# Altium schematic sheet Connector-side-2.SchDoc: =ProjectDescription
size 297 x 209 mm; Address1: Address1; Address2: Address2; Address3: Address3; Address4: Address4; SheetNumber: 7; SheetTotal: 7; Scale: 1:1; DocumentType: Схема электрическая принципиальная
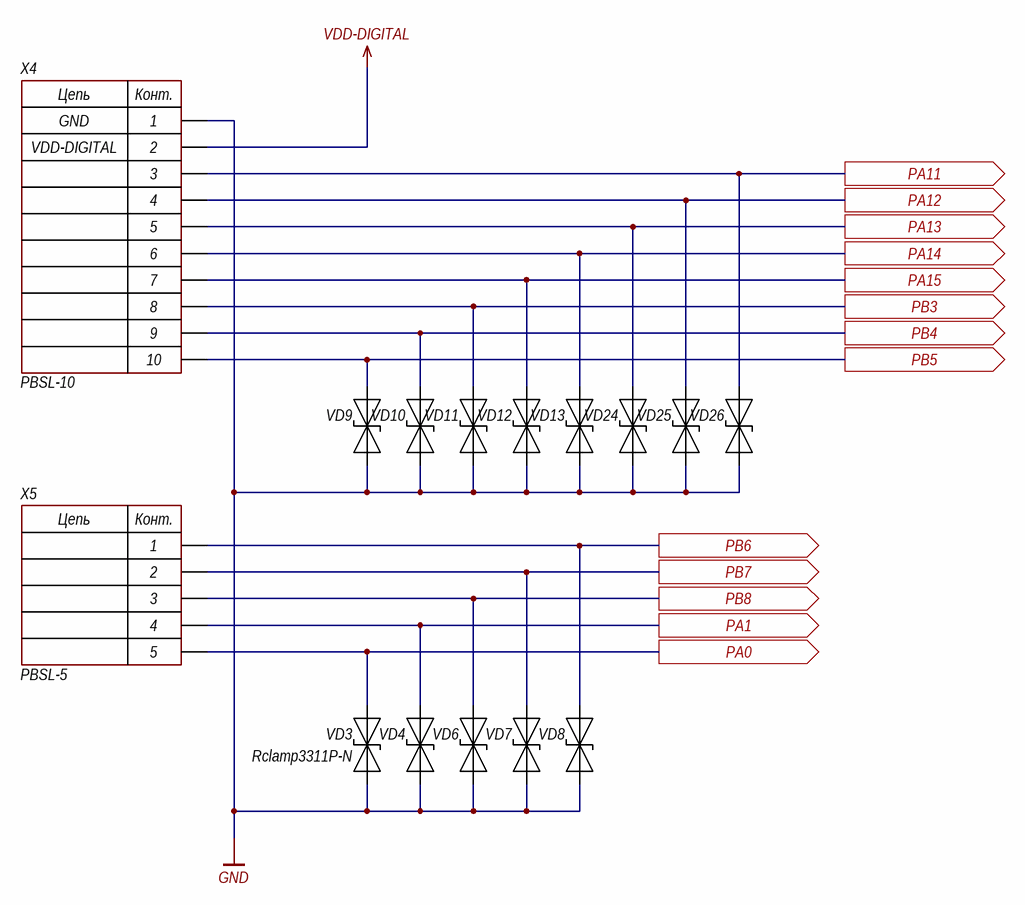
[diagram p0: Connector-side-2.SchDoc]

## Parts
VD3  Rclamp3311P-N  [DFN1006-2]
VD4  Rclamp3311P-N  [DFN1006-2]  (value not drawn)
VD6  Rclamp3311P-N  [DFN1006-2]  (value not drawn)
VD7  Rclamp3311P-N  [DFN1006-2]  (value not drawn)
VD8  Rclamp3311P-N  [DFN1006-2]  (value not drawn)
VD9  Rclamp3311P-N  [DFN1006-2]  (value not drawn)
VD10  Rclamp3311P-N  [DFN1006-2]  (value not drawn)
VD11  Rclamp3311P-N  [DFN1006-2]  (value not drawn)
VD12  Rclamp3311P-N  [DFN1006-2]  (value not drawn)
VD13  Rclamp3311P-N  [DFN1006-2]  (value not drawn)
VD24  Rclamp3311P-N  [DFN1006-2]  (value not drawn)
VD25  Rclamp3311P-N  [DFN1006-2]  (value not drawn)
VD26  Rclamp3311P-N  [DFN1006-2]  (value not drawn)
X4  PBSL-10  [CON: PBSL-10]
X5  PBSL-5  [CON: PBSL-5]

## Ports
PA0 (out), PA1 (out), PA11 (out), PA12 (out), PA13 (out), PA14 (out), PA15 (out), PB3 (out), PB4 (out), PB5 (out), PB6 (out), PB7 (out), PB8 (out)

## Nets
GND: VD3.1(A) VD4.1(A) VD6.1(A) VD7.1(A) VD8.1(A) VD9.1(A) VD10.1(A) VD11.1(A) VD12.1(A) VD13.1(A) VD24.1(A) VD25.1(A) VD26.1(A) X4.1
VDD-DIGITAL: X4.2
PA0: VD3.2(C) X5.5 ; port PA0
PA1: VD4.2(C) X5.4 ; port PA1
PA11: VD26.2(C) X4.3 ; port PA11
PA12: VD25.2(C) X4.4 ; port PA12
PA13: VD24.2(C) X4.5 ; port PA13
PA14: VD13.2(C) X4.6 ; port PA14
PA15: VD12.2(C) X4.7 ; port PA15
PB3: VD11.2(C) X4.8 ; port PB3
PB4: VD10.2(C) X4.9 ; port PB4
PB5: VD9.2(C) X4.10 ; port PB5
PB6: VD8.2(C) X5.1 ; port PB6
PB7: VD7.2(C) X5.2 ; port PB7
PB8: VD6.2(C) X5.3 ; port PB8

## Notes on the sheet
- GND
- VDD-DIGITAL
- Изм.
- Лист
- № докум.
- Подп.
- Дата
- Копировал
- Формат А4
- (in symbol 5-Connector) Цепь; Конт.
- (in symbol 10-Connector) Цепь; Конт.

## Library data of the parts
VD3 VD4 VD6-VD13 VD24-VD26 = TVS-diod: Manufacturer: BORN; ComponentKind: 3.3V, 8V. 10A; Model: Rclamp3311P-N; HelpURL: https://www.lcsc.com/product-detail/ESD-Protection-Devices_BORN-Rclamp3311P-N_C406234.html
X4 = 10-Connector: Model: PBSL-10; Manufacturer: *; HelpURL: *; ComponentKind: *
X5 = 5-Connector: Model: PBSL-5; Manufacturer: *; HelpURL: *; ComponentKind: *